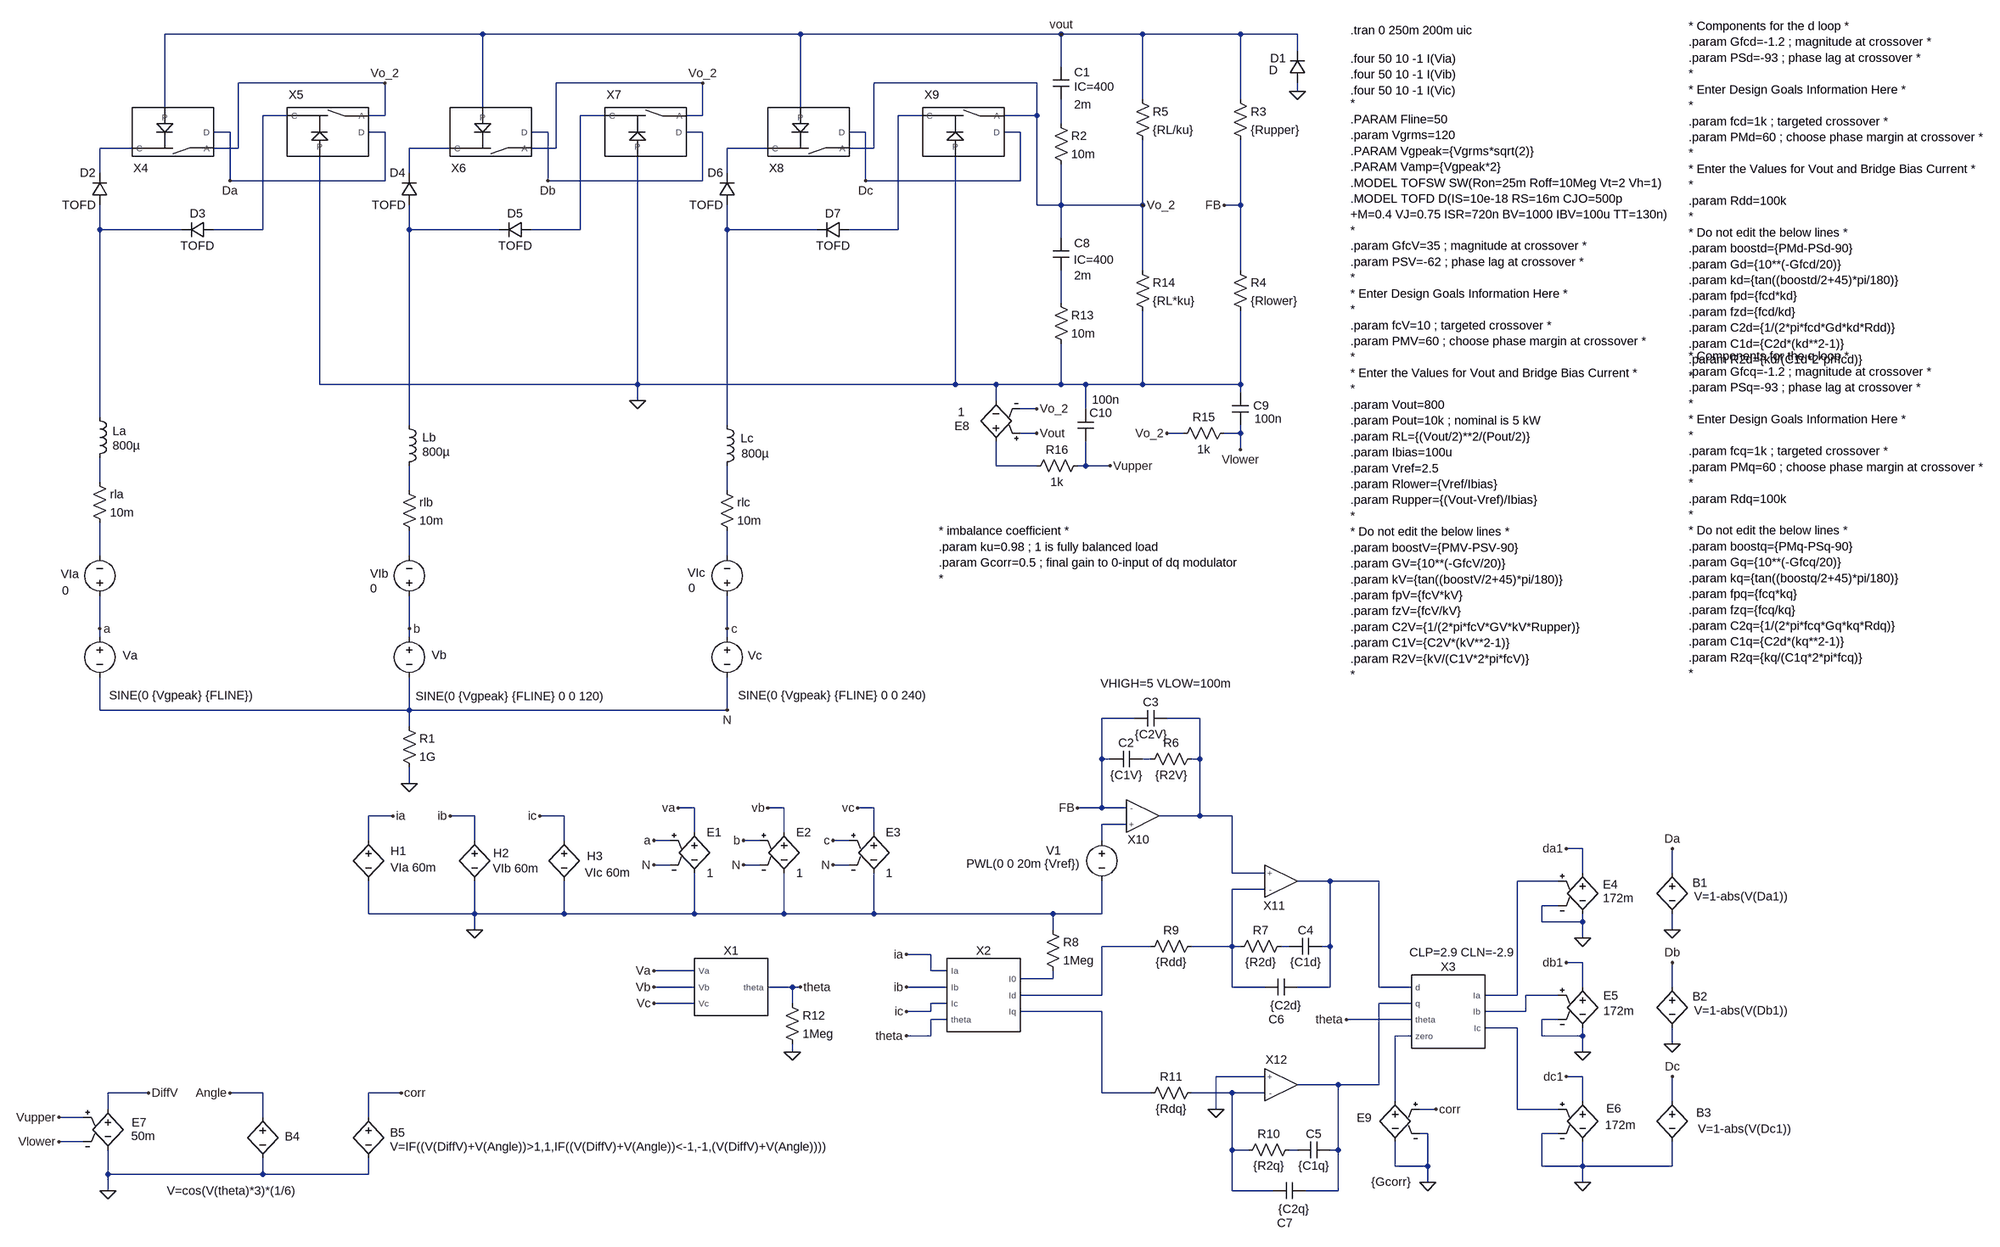
[diagram p0: schematic 3-phase Vienna PFC averaged model - balancing loop.asc]
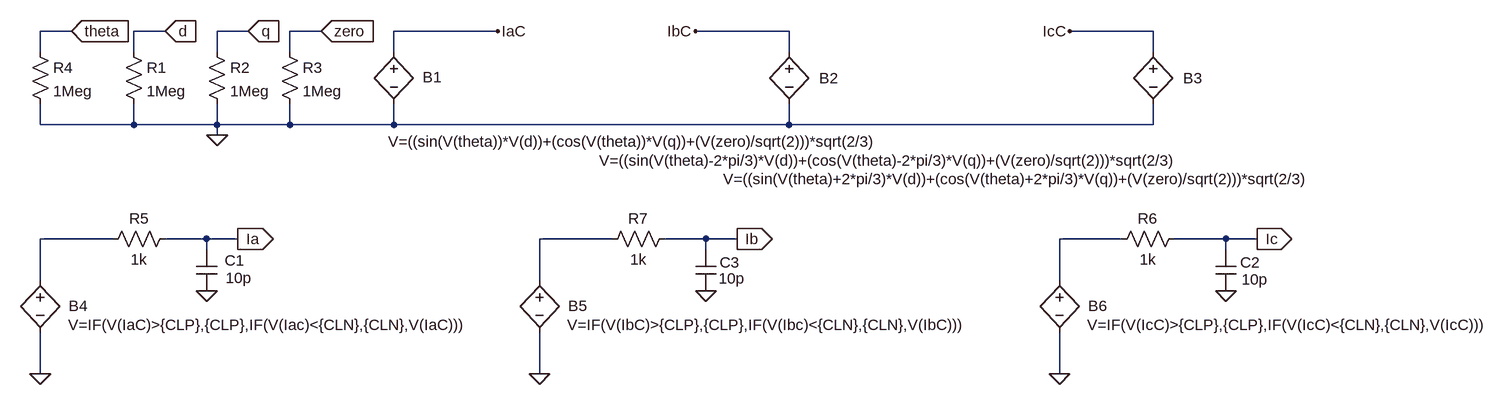
[diagram p1: sub-circuit inverse_dq0.asc]
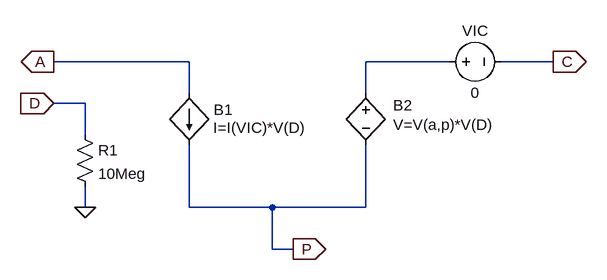
[diagram p2: sub-circuit pwmvm.asc]
3-phase Vienna PFC averaged model - balancing loop.asc, the LTspice schematic file:
Version 4
SHEET 1 4316 1596
WIRE 256 -992 -368 -992
WIRE 880 -992 256 -992
WIRE 1392 -992 880 -992
WIRE 1552 -992 1392 -992
WIRE 1744 -992 1552 -992
WIRE 1856 -992 1744 -992
WIRE 1856 -960 1856 -992
WIRE 1392 -928 1392 -992
WIRE 64 -896 -224 -896
WIRE 688 -896 400 -896
WIRE 1344 -896 1024 -896
WIRE 1856 -880 1856 -896
WIRE 1552 -864 1552 -992
WIRE 1744 -864 1744 -992
WIRE -368 -848 -368 -992
WIRE 256 -848 256 -992
WIRE 880 -848 880 -992
WIRE -128 -832 -176 -832
WIRE 64 -832 64 -896
WIRE 64 -832 32 -832
WIRE 496 -832 448 -832
WIRE 688 -832 688 -896
WIRE 688 -832 656 -832
WIRE 1120 -832 1072 -832
WIRE 1344 -832 1344 -896
WIRE 1344 -832 1280 -832
WIRE 1392 -816 1392 -864
WIRE -240 -800 -272 -800
WIRE 64 -800 32 -800
WIRE 384 -800 352 -800
WIRE 688 -800 656 -800
WIRE 1008 -800 976 -800
WIRE 1312 -800 1280 -800
WIRE -432 -768 -496 -768
WIRE -224 -768 -224 -896
WIRE -224 -768 -272 -768
WIRE 192 -768 112 -768
WIRE 400 -768 400 -896
WIRE 400 -768 352 -768
WIRE 816 -768 736 -768
WIRE 1024 -768 1024 -896
WIRE 1024 -768 976 -768
WIRE -496 -720 -496 -768
WIRE 112 -720 112 -768
WIRE 736 -720 736 -768
WIRE -240 -704 -240 -800
WIRE 64 -704 64 -800
WIRE 64 -704 -240 -704
WIRE 384 -704 384 -800
WIRE 688 -704 688 -800
WIRE 688 -704 384 -704
WIRE 1008 -704 1008 -800
WIRE 1312 -704 1312 -800
WIRE 1312 -704 1008 -704
WIRE 1344 -656 1344 -832
WIRE 1392 -656 1392 -736
WIRE 1392 -656 1344 -656
WIRE 1552 -656 1552 -784
WIRE 1552 -656 1392 -656
WIRE 1744 -656 1744 -784
WIRE 1744 -656 1712 -656
WIRE -496 -608 -496 -656
WIRE -336 -608 -496 -608
WIRE -176 -608 -176 -832
WIRE -176 -608 -272 -608
WIRE 112 -608 112 -656
WIRE 288 -608 112 -608
WIRE 448 -608 448 -832
WIRE 448 -608 352 -608
WIRE 736 -608 736 -656
WIRE 912 -608 736 -608
WIRE 1072 -608 1072 -832
WIRE 1072 -608 976 -608
WIRE 1392 -592 1392 -656
WIRE 1552 -528 1552 -656
WIRE 1744 -528 1744 -656
WIRE 1392 -464 1392 -528
WIRE -64 -304 -64 -752
WIRE 560 -304 560 -752
WIRE 560 -304 -64 -304
WIRE 1184 -304 1184 -752
WIRE 1184 -304 560 -304
WIRE 1264 -304 1184 -304
WIRE 1392 -304 1392 -384
WIRE 1392 -304 1264 -304
WIRE 1440 -304 1392 -304
WIRE 1552 -304 1552 -448
WIRE 1552 -304 1440 -304
WIRE 1744 -304 1744 -448
WIRE 1744 -304 1552 -304
WIRE 1744 -288 1744 -304
WIRE 560 -272 560 -304
WIRE 1264 -272 1264 -304
WIRE 1344 -256 1312 -256
WIRE 1440 -256 1440 -304
WIRE -496 -240 -496 -608
WIRE 112 -224 112 -608
WIRE 736 -224 736 -608
WIRE 1344 -208 1312 -208
WIRE 1632 -208 1600 -208
WIRE 1744 -208 1744 -224
WIRE 1744 -208 1712 -208
WIRE 1744 -176 1744 -208
WIRE 1264 -144 1264 -192
WIRE 1344 -144 1264 -144
WIRE 1440 -144 1440 -192
WIRE 1440 -144 1424 -144
WIRE 1488 -144 1440 -144
WIRE -496 -112 -496 -160
WIRE 112 -96 112 -144
WIRE 736 -96 736 -144
WIRE -496 32 -496 -32
WIRE 112 32 112 -16
WIRE 736 32 736 -16
WIRE -496 176 -496 112
WIRE 112 176 112 112
WIRE 736 176 736 112
WIRE -496 192 -496 176
WIRE 112 192 112 176
WIRE 736 192 736 176
WIRE -496 336 -496 272
WIRE 112 336 112 272
WIRE 112 336 -496 336
WIRE 736 336 736 272
WIRE 736 336 112 336
WIRE 1536 352 1472 352
WIRE 1664 352 1600 352
WIRE 112 368 112 336
WIRE 1472 432 1472 352
WIRE 1488 432 1472 432
WIRE 1568 432 1552 432
WIRE 1664 432 1664 352
WIRE 1664 432 1648 432
WIRE 112 480 112 448
WIRE 672 528 640 528
WIRE 848 528 816 528
WIRE 1024 528 992 528
WIRE 1472 528 1472 432
WIRE 1472 528 1424 528
WIRE 1520 528 1472 528
WIRE 80 544 32 544
WIRE 240 544 192 544
WIRE 416 544 368 544
WIRE 1664 544 1664 432
WIRE 1664 544 1584 544
WIRE 1728 544 1664 544
WIRE 1520 560 1472 560
WIRE 672 576 672 528
WIRE 848 576 848 528
WIRE 1024 576 1024 528
WIRE 32 592 32 544
WIRE 240 592 240 544
WIRE 416 592 416 544
WIRE 624 592 592 592
WIRE 800 592 768 592
WIRE 976 592 944 592
WIRE 1472 592 1472 560
WIRE 2416 608 2384 608
WIRE 624 640 592 640
WIRE 800 640 768 640
WIRE 976 640 944 640
WIRE 1728 656 1728 544
WIRE 1792 656 1728 656
WIRE 2416 656 2416 608
WIRE 2592 656 2592 608
WIRE 1920 672 1856 672
WIRE 2016 672 1920 672
WIRE 2368 672 2288 672
WIRE 1792 688 1728 688
WIRE 2368 720 2336 720
WIRE 32 736 32 672
WIRE 240 736 240 672
WIRE 240 736 32 736
WIRE 416 736 416 672
WIRE 416 736 240 736
WIRE 672 736 672 656
WIRE 672 736 416 736
WIRE 848 736 848 656
WIRE 848 736 672 736
WIRE 1024 736 1024 656
WIRE 1024 736 848 736
WIRE 1376 736 1024 736
WIRE 1472 736 1472 672
WIRE 1472 736 1376 736
WIRE 2336 752 2336 720
WIRE 2416 752 2416 736
WIRE 2416 752 2336 752
WIRE 240 768 240 736
WIRE 1376 768 1376 736
WIRE 2592 768 2592 736
WIRE 2416 784 2416 752
WIRE 1568 800 1472 800
WIRE 1728 800 1728 688
WIRE 1728 800 1648 800
WIRE 1744 800 1728 800
WIRE 1840 800 1824 800
WIRE 1920 800 1920 672
WIRE 1920 800 1904 800
WIRE 1136 816 1088 816
WIRE 2416 832 2384 832
WIRE 672 848 592 848
WIRE 1136 848 1136 816
WIRE 1168 848 1136 848
WIRE 1376 864 1376 848
WIRE 1376 864 1312 864
WIRE 672 880 592 880
WIRE 864 880 816 880
WIRE 880 880 864 880
WIRE 1168 880 1088 880
WIRE 1728 880 1728 800
WIRE 1792 880 1728 880
WIRE 1920 880 1920 800
WIRE 1920 880 1856 880
WIRE 2016 880 2016 672
WIRE 2080 880 2016 880
WIRE 2416 880 2416 832
WIRE 2592 880 2592 832
WIRE 1472 896 1472 800
WIRE 1472 896 1312 896
WIRE 2288 896 2288 672
WIRE 2288 896 2224 896
WIRE 2368 896 2304 896
WIRE 672 912 592 912
WIRE 864 912 864 880
WIRE 1168 912 1136 912
WIRE 2080 912 2016 912
WIRE 1136 928 1136 912
WIRE 1136 928 1088 928
WIRE 1472 928 1312 928
WIRE 2304 928 2304 896
WIRE 2304 928 2224 928
WIRE 1168 944 1136 944
WIRE 2080 944 1952 944
WIRE 2368 944 2336 944
WIRE 2288 960 2224 960
WIRE 1136 976 1136 944
WIRE 1136 976 1088 976
WIRE 2080 976 2048 976
WIRE 2336 976 2336 944
WIRE 2416 976 2416 960
WIRE 2416 976 2336 976
WIRE 2592 992 2592 960
WIRE 864 1008 864 992
WIRE 2416 1008 2416 976
WIRE 1792 1056 1696 1056
WIRE 2416 1056 2384 1056
WIRE 1936 1072 1856 1072
WIRE 2016 1072 2016 912
WIRE 2016 1072 1936 1072
WIRE -400 1088 -480 1088
WIRE -176 1088 -240 1088
WIRE 96 1088 32 1088
WIRE 1472 1088 1472 928
WIRE 1568 1088 1472 1088
WIRE 1728 1088 1648 1088
WIRE 1792 1088 1728 1088
WIRE 2048 1104 2048 976
WIRE 2416 1104 2416 1056
WIRE 2592 1104 2592 1056
WIRE -480 1120 -480 1088
WIRE 1696 1120 1696 1056
WIRE 2128 1120 2096 1120
WIRE 2288 1120 2288 960
WIRE 2368 1120 2288 1120
WIRE -528 1136 -576 1136
WIRE -176 1136 -176 1088
WIRE 32 1136 32 1088
WIRE 2112 1168 2096 1168
WIRE 2368 1168 2336 1168
WIRE -528 1184 -576 1184
WIRE 1728 1200 1728 1088
WIRE 1760 1200 1728 1200
WIRE 1856 1200 1840 1200
WIRE 1936 1200 1936 1072
WIRE 1936 1200 1920 1200
WIRE 2048 1232 2048 1184
WIRE 2112 1232 2112 1168
WIRE 2112 1232 2048 1232
WIRE 2336 1232 2336 1168
WIRE 2416 1232 2416 1184
WIRE 2416 1232 2336 1232
WIRE 2592 1232 2592 1184
WIRE 2592 1232 2416 1232
WIRE -480 1248 -480 1200
WIRE -176 1248 -176 1216
WIRE -176 1248 -480 1248
WIRE 32 1248 32 1216
WIRE 32 1248 -176 1248
WIRE 2112 1264 2112 1232
WIRE 2416 1264 2416 1232
WIRE -480 1280 -480 1248
WIRE 1728 1280 1728 1200
WIRE 1808 1280 1728 1280
WIRE 1936 1280 1936 1200
WIRE 1936 1280 1872 1280
FLAG 112 480 0
FLAG 80 544 ia
FLAG 192 544 ib
FLAG 368 544 ic
FLAG -496 176 a
FLAG 112 176 b
FLAG 736 176 c
FLAG 240 768 0
FLAG 640 528 va
FLAG 736 336 N
FLAG 592 640 N
FLAG 592 592 a
FLAG 816 528 vb
FLAG 768 640 N
FLAG 768 592 b
FLAG 992 528 vc
FLAG 944 640 N
FLAG 944 592 c
FLAG 880 880 theta
FLAG 592 848 Va
FLAG 592 880 Vb
FLAG 592 912 Vc
FLAG 1088 816 ia
FLAG 1088 880 ib
FLAG 1088 928 ic
FLAG 1088 976 theta
FLAG 1424 528 FB
FLAG 1696 1120 0
FLAG 1952 944 theta
FLAG 864 1008 0
FLAG 2384 608 da1
FLAG 2416 784 0
FLAG 2384 832 db1
FLAG 2416 1008 0
FLAG 2384 1056 dc1
FLAG 2416 1264 0
FLAG -240 -704 Da
FLAG 1712 -656 FB
FLAG 1552 -656 Vo_2
FLAG 64 -896 Vo_2
FLAG 384 -704 Db
FLAG 688 -896 Vo_2
FLAG 1008 -704 Dc
FLAG 1856 -880 0
FLAG 2592 768 0
FLAG 2592 992 0
FLAG 2592 608 Da
FLAG 2592 832 Db
FLAG 2592 1056 Dc
FLAG 560 -272 0
FLAG 1392 -992 vout
FLAG -576 1136 Vupper
FLAG -576 1184 Vlower
FLAG -480 1280 0
FLAG -400 1088 DiffV
FLAG -240 1088 Angle
FLAG 96 1088 corr
FLAG 1600 -208 Vo_2
FLAG 1744 -176 Vlower
FLAG 1344 -256 Vo_2
FLAG 1344 -208 Vout
FLAG 1488 -144 Vupper
FLAG 2128 1120 corr
FLAG 2112 1264 0
SYMBOL voltage -496 176 R0
WINDOW 0 45 53 Left 2
WINDOW 3 19 131 Left 2
WINDOW 123 0 0 Left 0
WINDOW 39 0 0 Left 0
SYMATTR InstName Va
SYMATTR Value SINE(0 {Vgpeak} {FLINE})
SYMBOL voltage 112 176 R0
WINDOW 0 44 52 Left 2
WINDOW 3 12 133 Left 2
WINDOW 123 0 0 Left 0
WINDOW 39 0 0 Left 0
SYMATTR InstName Vb
SYMATTR Value SINE(0 {Vgpeak} {FLINE} 0 0 120)
SYMBOL voltage 736 176 R0
WINDOW 0 41 53 Left 2
WINDOW 3 22 131 Left 2
WINDOW 123 0 0 Left 0
WINDOW 39 0 0 Left 0
SYMATTR InstName Vc
SYMATTR Value SINE(0 {Vgpeak} {FLINE} 0 0 240)
SYMBOL res 96 352 R0
SYMATTR InstName R1
SYMATTR Value 1G
SYMBOL res -512 -128 R0
SYMATTR InstName rla
SYMATTR Value 10m
SYMBOL res 96 -112 R0
SYMATTR InstName rlb
SYMATTR Value 10m
SYMBOL res 720 -112 R0
SYMATTR InstName rlc
SYMATTR Value 10m
SYMBOL h 32 576 R0
WINDOW 0 43 37 Left 2
WINDOW 3 43 69 Left 2
SYMATTR InstName H1
SYMATTR Value VIa 60m
SYMBOL h 240 576 R0
WINDOW 0 37 41 Left 2
WINDOW 3 36 71 Left 2
SYMATTR InstName H2
SYMATTR Value VIb 60m
SYMBOL h 416 576 R0
WINDOW 0 45 47 Left 2
WINDOW 3 41 79 Left 2
SYMATTR InstName H3
SYMATTR Value VIc 60m
SYMBOL ind -512 -256 R0
WINDOW 0 41 44 Left 2
WINDOW 3 41 72 Left 2
SYMATTR InstName La
SYMATTR Value 800µ
SYMBOL ind 96 -240 R0
WINDOW 0 42 40 Left 2
WINDOW 3 42 69 Left 2
SYMATTR InstName Lb
SYMATTR Value 800µ
SYMBOL ind 720 -240 R0
WINDOW 0 43 42 Left 2
WINDOW 3 44 72 Left 2
SYMATTR InstName Lc
SYMATTR Value 800µ
SYMBOL voltage -496 128 R180
WINDOW 0 40 59 Left 2
WINDOW 3 60 27 Left 2
WINDOW 123 0 0 Left 0
WINDOW 39 0 0 Left 0
SYMATTR InstName VIa
SYMATTR Value 0
SYMBOL voltage 112 128 R180
WINDOW 0 41 60 Left 2
WINDOW 3 63 31 Left 2
WINDOW 123 0 0 Left 0
WINDOW 39 0 0 Left 0
SYMATTR InstName VIb
SYMATTR Value 0
SYMBOL voltage 736 128 R180
WINDOW 0 43 62 Left 2
WINDOW 3 62 32 Left 2
WINDOW 123 0 0 Left 0
WINDOW 39 0 0 Left 0
SYMATTR InstName VIc
SYMATTR Value 0
SYMBOL e 672 560 R0
SYMATTR InstName E1
SYMATTR Value 1
SYMBOL e 848 560 R0
SYMATTR InstName E2
SYMATTR Value 1
SYMBOL e 1024 560 R0
SYMATTR InstName E3
SYMATTR Value 1
SYMBOL theta_sub 736 880 R0
SYMATTR InstName X1
SYMBOL dq0_sub 1232 896 R0
SYMATTR InstName X2
SYMBOL res 1664 416 R90
WINDOW 0 0 56 VBottom 2
WINDOW 3 32 56 VTop 2
SYMATTR InstName R6
SYMATTR Value {R2V}
SYMBOL cap 1552 416 R90
WINDOW 0 0 32 VBottom 2
WINDOW 3 32 32 VTop 2
SYMATTR InstName C2
SYMATTR Value {C1V}
SYMBOL cap 1600 336 R90
WINDOW 0 0 32 VBottom 2
WINDOW 3 32 32 VTop 2
SYMATTR InstName C3
SYMATTR Value {C2V}
SYMBOL res 1728 816 R270
WINDOW 0 32 56 VTop 2
WINDOW 3 0 56 VBottom 2
SYMATTR InstName R7
SYMATTR Value {R2d}
SYMBOL cap 1840 816 R270
WINDOW 0 32 32 VTop 2
WINDOW 3 0 32 VBottom 2
SYMATTR InstName C4
SYMATTR Value {C1d}
SYMBOL cap 1792 896 R270
WINDOW 0 -63 23 VTop 2
WINDOW 3 -5 41 VBottom 2
SYMATTR InstName C6
SYMATTR Value {C2d}
SYMBOL res 1360 752 R0
SYMATTR InstName R8
SYMATTR Value 1Meg
SYMBOL res 1664 784 R90
WINDOW 0 0 56 VBottom 2
WINDOW 3 32 56 VTop 2
SYMATTR InstName R9
SYMATTR Value {Rdd}
SYMBOL res 1744 1216 R270
WINDOW 0 32 56 VTop 2
WINDOW 3 0 56 VBottom 2
SYMATTR InstName R10
SYMATTR Value {R2q}
SYMBOL cap 1856 1216 R270
WINDOW 0 32 32 VTop 2
WINDOW 3 0 32 VBottom 2
SYMATTR InstName C5
SYMATTR Value {C1q}
SYMBOL cap 1808 1296 R270
WINDOW 0 -63 23 VTop 2
WINDOW 3 -5 41 VBottom 2
SYMATTR InstName C7
SYMATTR Value {C2q}
SYMBOL res 1664 1072 R90
WINDOW 0 0 56 VBottom 2
WINDOW 3 32 56 VTop 2
SYMATTR InstName R11
SYMATTR Value {Rdq}
SYMBOL Inverse_dq0 2144 928 R0
WINDOW 39 35 -100 Bottom 2
SYMATTR SpiceLine CLP=2.9 CLN=-2.9
SYMATTR InstName X3
SYMBOL res 848 896 R0
SYMATTR InstName R12
SYMATTR Value 1Meg
SYMBOL opampTOF 1584 528 R0
WINDOW 0 -40 78 Bottom 2
WINDOW 39 13 -229 Bottom 2
SYMATTR InstName X10
SYMATTR SpiceLine VHIGH=5 VLOW=100m
SYMBOL opampTOF 1856 688 M180
WINDOW 0 -45 -17 Bottom 2
SYMATTR InstName X11
SYMATTR SpiceLine VHIGH=8 VLOW=-8
SYMBOL opampTOF 1856 1088 M180
WINDOW 0 -41 81 Bottom 2
SYMATTR InstName X12
SYMATTR SpiceLine VHIGH=8 VLOW=-8
SYMBOL e 2416 640 R0
WINDOW 0 40 39 Left 2
WINDOW 3 40 65 Left 2
SYMATTR InstName E4
SYMATTR Value 172m
SYMBOL e 2416 864 R0
WINDOW 0 41 33 Left 2
WINDOW 3 41 63 Left 2
SYMATTR InstName E5
SYMATTR Value 172m
SYMBOL e 2416 1088 R0
WINDOW 0 47 31 Left 2
WINDOW 3 44 63 Left 2
SYMATTR InstName E6
SYMATTR Value 172m
SYMBOL diode 1872 -896 R180
WINDOW 0 39 49 Left 2
WINDOW 3 55 25 Left 2
SYMATTR InstName D1
SYMBOL PWMVM -336 -784 R180
WINDOW 0 79 -40 Bottom 2
SYMATTR InstName X4
SYMBOL cap 1376 -928 R0
WINDOW 0 42 11 Left 2
WINDOW 3 42 74 Left 2
WINDOW 123 42 39 Left 2
SYMATTR InstName C1
SYMATTR Value 2m
SYMATTR Value2 IC=400
SYMBOL res 1376 -832 R0
SYMATTR InstName R2
SYMATTR Value 10m
SYMBOL res 1728 -880 R0
SYMATTR InstName R3
SYMATTR Value {Rupper}
SYMBOL res 1728 -544 R0
SYMATTR InstName R4
SYMATTR Value {Rlower}
SYMBOL res 1536 -880 R0
SYMATTR InstName R5
SYMATTR Value {RL/ku}
SYMBOL cap 1376 -592 R0
WINDOW 0 42 11 Left 2
WINDOW 3 42 74 Left 2
WINDOW 123 41 43 Left 2
SYMATTR InstName C8
SYMATTR Value 2m
SYMATTR Value2 IC=400
SYMBOL res 1376 -480 R0
SYMATTR InstName R13
SYMATTR Value 10m
SYMBOL res 1536 -544 R0
SYMATTR InstName R14
SYMATTR Value {RL*ku}
SYMBOL diode -480 -656 R180
WINDOW 0 24 64 Left 2
WINDOW 3 24 0 Left 2
SYMATTR InstName D2
SYMATTR Value TOFD
SYMBOL diode -272 -624 R90
WINDOW 0 0 32 VBottom 2
WINDOW 3 32 32 VTop 2
SYMATTR InstName D3
SYMATTR Value TOFD
SYMBOL PWMVM -32 -816 M0
WINDOW 0 78 -41 Bottom 2
SYMATTR InstName X5
SYMBOL PWMVM 288 -784 R180
WINDOW 0 79 -40 Bottom 2
SYMATTR InstName X6
SYMBOL diode 128 -656 R180
WINDOW 0 24 64 Left 2
WINDOW 3 24 0 Left 2
SYMATTR InstName D4
SYMATTR Value TOFD
SYMBOL diode 352 -624 R90
WINDOW 0 0 32 VBottom 2
WINDOW 3 32 32 VTop 2
SYMATTR InstName D5
SYMATTR Value TOFD
SYMBOL PWMVM 592 -816 M0
WINDOW 0 78 -41 Bottom 2
SYMATTR InstName X7
SYMBOL PWMVM 912 -784 R180
WINDOW 0 79 -40 Bottom 2
SYMATTR InstName X8
SYMBOL diode 752 -656 R180
WINDOW 0 24 64 Left 2
WINDOW 3 24 0 Left 2
SYMATTR InstName D6
SYMATTR Value TOFD
SYMBOL diode 976 -624 R90
WINDOW 0 0 32 VBottom 2
WINDOW 3 32 32 VTop 2
SYMATTR InstName D7
SYMATTR Value TOFD
SYMBOL PWMVM 1216 -816 M0
WINDOW 0 78 -41 Bottom 2
SYMATTR InstName X9
SYMBOL bv 2592 640 R0
WINDOW 0 40 35 Left 2
WINDOW 3 43 62 Left 2
SYMATTR InstName B1
SYMATTR Value V=1-abs(V(Da1))
SYMBOL bv 2592 864 R0
WINDOW 0 40 35 Left 2
WINDOW 3 43 62 Left 2
SYMATTR InstName B2
SYMATTR Value V=1-abs(V(Db1))
SYMBOL bv 2592 1088 R0
WINDOW 0 47 39 Left 2
WINDOW 3 51 71 Left 2
SYMATTR InstName B3
SYMATTR Value V=1-abs(V(Dc1))
SYMBOL voltage 1472 576 M0
WINDOW 0 80 36 Left 2
WINDOW 3 43 62 Left 2
WINDOW 123 0 0 Left 0
WINDOW 39 0 0 Left 0
SYMATTR InstName V1
SYMATTR Value PWL(0 0 20m {Vref})
SYMBOL e -480 1104 R0
WINDOW 0 47 42 Left 2
WINDOW 3 46 69 Left 2
SYMATTR InstName E7
SYMATTR Value 50m
SYMBOL bv -176 1120 R0
WINDOW 0 44 54 Left 2
WINDOW 3 -188 160 Left 2
SYMATTR InstName B4
SYMATTR Value V=cos(V(theta)*3)*(1/6)
SYMBOL bv 32 1120 R0
WINDOW 0 42 46 Left 2
WINDOW 3 42 74 Left 2
SYMATTR InstName B5
SYMATTR Value V=IF((V(DiffV)+V(Angle))>1,1,IF((V(DiffV)+V(Angle))<-1,-1,(V(DiffV)+V(Angle))))
SYMBOL res 1728 -224 R90
WINDOW 0 0 56 VBottom 2
WINDOW 3 32 56 VTop 2
SYMATTR InstName R15
SYMATTR Value 1k
SYMBOL cap 1728 -288 R0
WINDOW 0 41 26 Left 2
WINDOW 3 44 52 Left 2
SYMATTR InstName C9
SYMATTR Value 100n
SYMBOL res 1440 -160 R90
WINDOW 0 0 56 VBottom 2
WINDOW 3 32 56 VTop 2
SYMATTR InstName R16
SYMATTR Value 1k
SYMBOL cap 1424 -256 R0
WINDOW 3 29 -18 Left 2
SYMATTR Value 100n
SYMATTR InstName C10
SYMBOL e 1264 -176 R180
WINDOW 0 52 46 Left 2
WINDOW 3 61 74 Left 2
SYMATTR InstName E8
SYMATTR Value 1
SYMBOL e 2048 1088 M0
WINDOW 0 46 49 Left 2
WINDOW 3 -30 175 Left 2
SYMATTR InstName E9
SYMATTR Value {Gcorr}
TEXT 1960 -856 Left 2 !*\n.PARAM Fline=50\n.param Vgrms=120\n.PARAM Vgpeak={Vgrms*sqrt(2)}\n.PARAM Vamp={Vgpeak*2}\n.MODEL TOFSW SW(Ron=25m Roff=10Meg Vt=2 Vh=1)\n.MODEL TOFD D(IS=10e-18 RS=16m CJO=500p \n+M=0.4 VJ=0.75 ISR=720n BV=1000 IBV=100u TT=130n)\n*
TEXT 1960 -1000 Left 2 !.tran 0 250m 200m uic
TEXT 1960 -944 Left 2 !.four 50 10 -1 I(Via)\n.four 50 10 -1 I(Vib)\n.four 50 10 -1 I(Vic)
TEXT 2624 -1008 Left 2 !* Components for the d loop *\n.param Gfcd=-1.2 ; magnitude at crossover *\n.param PSd=-93 ; phase lag at crossover *\n*\n* Enter Design Goals Information Here *\n*\n.param fcd=1k ; targeted crossover *\n.param PMd=60 ; choose phase margin at crossover *\n*\n* Enter the Values for Vout and Bridge Bias Current *\n*\n.param Rdd=100k\n*\n* Do not edit the below lines *\n.param boostd={PMd-PSd-90}\n.param Gd={10**(-Gfcd/20)}\n.param kd={tan((boostd/2+45)*pi/180)}\n.param fpd={fcd*kd}\n.param fzd={fcd/kd}\n.param C2d={1/(2*pi*fcd*Gd*kd*Rdd)}\n.param C1d={C2d*(kd**2-1)}\n.param R2d={kd/(C1d*2*pi*fcd)}\n*
TEXT 2624 -360 Left 2 !* Components for the q loop *\n.param Gfcq=-1.2 ; magnitude at crossover *\n.param PSq=-93 ; phase lag at crossover *\n*\n* Enter Design Goals Information Here *\n*\n.param fcq=1k ; targeted crossover *\n.param PMq=60 ; choose phase margin at crossover *\n*\n.param Rdq=100k\n*\n* Do not edit the below lines *\n.param boostq={PMq-PSq-90}\n.param Gq={10**(-Gfcq/20)}\n.param kq={tan((boostq/2+45)*pi/180)}\n.param fpq={fcq*kq}\n.param fzq={fcq/kq}\n.param C2q={1/(2*pi*fcq*Gq*kq*Rdq)}\n.param C1q={C2d*(kq**2-1)}\n.param R2q={kq/(C1q*2*pi*fcq)}\n*
TEXT 1960 -576 Left 2 !.param GfcV=35 ; magnitude at crossover *\n.param PSV=-62 ; phase lag at crossover *\n*\n* Enter Design Goals Information Here *\n*\n.param fcV=10 ; targeted crossover *\n.param PMV=60 ; choose phase margin at crossover *\n*\n* Enter the Values for Vout and Bridge Bias Current *\n*\n.param Vout=800\n.param Pout=10k ; nominal is 5 kW\n.param RL={(Vout/2)**2/(Pout/2)}\n.param Ibias=100u\n.param Vref=2.5\n.param Rlower={Vref/Ibias}\n.param Rupper={(Vout-Vref)/Ibias}\n*\n* Do not edit the below lines *\n.param boostV={PMV-PSV-90}\n.param GV={10**(-GfcV/20)}\n.param kV={tan((boostV/2+45)*pi/180)}\n.param fpV={fcV*kV}\n.param fzV={fcV/kV}\n.param C2V={1/(2*pi*fcV*GV*kV*Rupper)}\n.param C1V={C2V*(kV**2-1)}\n.param R2V={kV/(C1V*2*pi*fcV)}\n*
TEXT 1152 -16 Left 2 !* imbalance coefficient *\n.param ku=0.98 ; 1 is fully balanced load\n.param Gcorr=0.5 ; final gain to 0-input of dq modulator\n*

inverse_dq0.asc, the sub-circuit schematic file:
Version 4
SHEET 1 1804 980
WIRE -464 16 -512 16
WIRE -320 16 -368 16
WIRE -192 16 -240 16
WIRE -80 16 -128 16
WIRE 192 16 32 16
WIRE 640 16 496 16
WIRE 1200 16 1072 16
WIRE -512 48 -512 16
WIRE -368 48 -368 16
WIRE -240 48 -240 16
WIRE -128 48 -128 16
WIRE 32 48 32 16
WIRE 640 48 640 16
WIRE 1200 48 1200 16
WIRE -512 160 -512 128
WIRE -368 160 -368 128
WIRE -368 160 -512 160
WIRE -240 160 -240 128
WIRE -240 160 -368 160
WIRE -128 160 -128 128
WIRE -128 160 -240 160
WIRE 32 160 32 128
WIRE 32 160 -128 160
WIRE 640 160 640 128
WIRE 640 160 32 160
WIRE 1200 160 1200 128
WIRE 1200 160 640 160
WIRE -240 176 -240 160
WIRE -400 336 -512 336
WIRE -256 336 -320 336
WIRE -208 336 -256 336
WIRE 368 336 256 336
WIRE 512 336 448 336
WIRE 560 336 512 336
WIRE 1152 336 1056 336
WIRE 1312 336 1232 336
WIRE 1360 336 1312 336
WIRE -256 352 -256 336
WIRE 512 352 512 336
WIRE 1312 352 1312 336
WIRE -512 400 -512 336
WIRE 256 400 256 336
WIRE 1056 400 1056 336
WIRE -512 544 -512 480
WIRE 256 544 256 480
WIRE 1056 544 1056 480
FLAG -240 176 0
FLAG -320 16 d
IOPIN -320 16 In
FLAG -192 16 q
IOPIN -192 16 In
FLAG -80 16 zero
IOPIN -80 16 In
FLAG 192 16 IaC
FLAG 496 16 IbC
FLAG 1072 16 IcC
FLAG -464 16 theta
IOPIN -464 16 In
FLAG -208 336 Ia
IOPIN -208 336 Out
FLAG -512 544 0
FLAG 560 336 Ib
IOPIN 560 336 Out
FLAG 256 544 0
FLAG 1360 336 Ic
IOPIN 1360 336 Out
FLAG 1056 544 0
FLAG -256 416 0
FLAG 1312 416 0
FLAG 512 416 0
SYMBOL res -384 32 R0
SYMATTR InstName R1
SYMATTR Value 1Meg
SYMBOL res -256 32 R0
SYMATTR InstName R2
SYMATTR Value 1Meg
SYMBOL res -144 32 R0
SYMATTR InstName R3
SYMATTR Value 1Meg
SYMBOL bv 32 32 R0
WINDOW 0 44 55 Left 2
WINDOW 3 -9 154 Left 2
SYMATTR InstName B1
SYMATTR Value V=((sin(V(theta))*V(d))+(cos(V(theta))*V(q))+(V(zero)/sqrt(2)))*sqrt(2/3)
SYMBOL bv 640 32 R0
WINDOW 0 46 56 Left 2
WINDOW 3 -292 183 Left 2
SYMATTR InstName B2
SYMATTR Value V=((sin(V(theta)-2*pi/3)*V(d))+(cos(V(theta)-2*pi/3)*V(q))+(V(zero)/sqrt(2)))*sqrt(2/3)
SYMBOL res -528 32 R0
SYMATTR InstName R4
SYMATTR Value 1Meg
SYMBOL bv 1200 32 R0
WINDOW 0 46 56 Left 2
WINDOW 3 -661 212 Left 2
SYMATTR InstName B3
SYMATTR Value V=((sin(V(theta)+2*pi/3)*V(d))+(cos(V(theta)+2*pi/3)*V(q))+(V(zero)/sqrt(2)))*sqrt(2/3)
SYMBOL bv -512 384 R0
WINDOW 0 44 55 Left 2
WINDOW 3 43 84 Left 2
SYMATTR InstName B4
SYMATTR Value V=IF(V(IaC)>{CLP},{CLP},IF(V(Iac)<{CLN},{CLN},V(IaC)))
SYMBOL bv 256 384 R0
WINDOW 0 44 55 Left 2
WINDOW 3 43 84 Left 2
SYMATTR InstName B5
SYMATTR Value V=IF(V(IbC)>{CLP},{CLP},IF(V(Ibc)<{CLN},{CLN},V(IbC)))
SYMBOL bv 1056 384 R0
WINDOW 0 44 55 Left 2
WINDOW 3 43 84 Left 2
SYMATTR InstName B6
SYMATTR Value V=IF(V(IcC)>{CLP},{CLP},IF(V(IcC)<{CLN},{CLN},V(IcC)))
SYMBOL res -304 320 R90
WINDOW 0 0 56 VBottom 2
WINDOW 3 32 56 VTop 2
SYMATTR InstName R5
SYMATTR Value 1k
SYMBOL res 1248 320 R90
WINDOW 0 0 56 VBottom 2
WINDOW 3 32 56 VTop 2
SYMATTR InstName R6
SYMATTR Value 1k
SYMBOL res 464 320 R90
WINDOW 0 0 56 VBottom 2
WINDOW 3 32 56 VTop 2
SYMATTR InstName R7
SYMATTR Value 1k
SYMBOL cap -272 352 R0
WINDOW 0 44 17 Left 2
WINDOW 3 45 44 Left 2
SYMATTR InstName C1
SYMATTR Value 10p
SYMBOL cap 1296 352 R0
WINDOW 0 38 20 Left 2
WINDOW 3 40 46 Left 2
SYMATTR InstName C2
SYMATTR Value 10p
SYMBOL cap 496 352 R0
WINDOW 0 37 20 Left 2
WINDOW 3 36 45 Left 2
SYMATTR InstName C3
SYMATTR Value 10p

pwmvm.asc, the sub-circuit schematic file:
Version 4
SHEET 1 880 680
WIRE 64 48 -144 48
WIRE 464 48 336 48
WIRE 624 48 544 48
WIRE 64 96 64 48
WIRE 336 96 336 48
WIRE -96 112 -144 112
WIRE -96 160 -96 112
WIRE -96 272 -96 240
WIRE 64 272 64 176
WIRE 192 272 64 272
WIRE 336 272 336 176
WIRE 336 272 192 272
WIRE 192 336 192 272
WIRE 224 336 192 336
FLAG -96 272 0
FLAG -144 48 A
IOPIN -144 48 Out
FLAG 624 48 C
IOPIN 624 48 Out
FLAG 224 336 P
IOPIN 224 336 Out
FLAG -144 112 D
IOPIN -144 112 In
SYMBOL bi 64 96 R0
WINDOW 0 38 26 Left 2
WINDOW 3 37 53 Left 2
SYMATTR InstName B1
SYMATTR Value I=I(VIC)*V(D)
SYMBOL bv 336 80 R0
WINDOW 0 42 35 Left 2
WINDOW 3 42 65 Left 2
SYMATTR InstName B2
SYMATTR Value V=V(a,p)*V(D)
SYMBOL voltage 448 48 R270
WINDOW 0 32 56 VTop 2
WINDOW 3 -32 56 VBottom 2
WINDOW 123 0 0 Left 0
WINDOW 39 0 0 Left 0
SYMATTR InstName VIC
SYMATTR Value 0
SYMBOL res -112 144 R0
SYMATTR InstName R1
SYMATTR Value 10Meg

The netlist it stands for:
* 3-phase Vienna PFC averaged model - balancing loop.asc
Va a N SINE(0 {Vgpeak} {FLINE})
Vb b N SINE(0 {Vgpeak} {FLINE} 0 0 120)
Vc c N SINE(0 {Vgpeak} {FLINE} 0 0 240)
R1 N 0 1G
rla N013 N016 10m
rlb N014 N017 10m
rlc N015 N018 10m
H1 ia 0 VIa 60m
H2 ib 0 VIb 60m
H3 ic 0 VIc 60m
La N008 N013 800µ
Lb N009 N014 800µ
Lc N010 N015 800µ
VIa a N016 0
VIb b N017 0
VIc c N018 0
E1 va 0 a N 1
E2 vb 0 b N 1
E3 vc 0 c N 1
XX1 va vb vc theta theta_sub  ; pins Va Vb Vc theta
XX2 ia ib ic theta N027 N025 N030 dq0_sub  ; pins Ia Ib Ic theta I0 Id Iq
R6 N019 N020 {R2V}
C2 N020 FB {C1V}
C3 N019 FB {C2V}
R7 N024 N026 {R2d}
C4 N026 N022 {C1d}
C6 N024 N022 {C2d}
R8 0 N027 1Meg
R9 N024 N025 {Rdd}
R10 N033 N034 {R2q}
C5 N034 N029 {C1q}
C7 N033 N029 {C2q}
R11 N033 N030 {Rdq}
XX3 N022 N029 theta N032 N023 N028 N031 inverse_dq0 params: CLP=2.9 CLN=-2.9
R12 theta 0 1Meg
XX10 FB N021 N019 opampTOF params: VHIGH=5 VLOW=100m  ; pins - + OUT
XX11 N024 N019 N022 opampTOF params: VHIGH=8 VLOW=-8  ; pins - + OUT
XX12 N033 0 N029 opampTOF params: VHIGH=8 VLOW=-8  ; pins - + OUT
E4 da1 0 N023 0 172m
E5 db1 0 N028 0 172m
E6 dc1 0 N031 0 172m
D1 0 vout D
XX4 Da Vo_2 N005 vout pwmvm
C1 vout N004 2m IC=400
R2 N004 Vo_2 10m
R3 vout FB {Rupper}
R4 FB 0 {Rlower}
R5 vout Vo_2 {RL/ku}
C8 Vo_2 N011 2m IC=400
R13 N011 0 10m
R14 Vo_2 0 {RL*ku}
D2 N008 N005 TOFD
D3 N001 N008 TOFD
XX5 Da Vo_2 N001 0 pwmvm
XX6 Db Vo_2 N006 vout pwmvm
D4 N009 N006 TOFD
D5 N002 N009 TOFD
XX7 Db Vo_2 N002 0 pwmvm
XX8 Dc Vo_2 N007 vout pwmvm
D6 N010 N007 TOFD
D7 N003 N010 TOFD
XX9 Dc Vo_2 N003 0 pwmvm
B1 Da 0 V=1-abs(V(Da1))
B2 Db 0 V=1-abs(V(Db1))
B3 Dc 0 V=1-abs(V(Dc1))
V1 N021 0 PWL(0 0 20m {Vref})
E7 DiffV 0 Vupper Vlower 50m
B4 Angle 0 V=cos(V(theta)*3)*(1/6)
B5 corr 0 V=IF((V(DiffV)+V(Angle))>1,1,IF((V(DiffV)+V(Angle))<-1,-1,(V(DiffV)+V(Angle))))
R15 Vlower Vo_2 1k
C9 0 Vlower 100n
R16 Vupper N012 1k
C10 0 Vupper 100n
E8 N012 0 vout Vo_2 1
E9 N032 0 corr 0 {Gcorr}

* block symbol definitions
.subckt inverse_dq0 d q theta zero Ia Ib Ic
R1 d 0 1Meg
R2 q 0 1Meg
R3 zero 0 1Meg
B1 IaC 0 V=((sin(V(theta))*V(d))+(cos(V(theta))*V(q))+(V(zero)/sqrt(2)))*sqrt(2/3)
B2 IbC 0 V=((sin(V(theta)-2*pi/3)*V(d))+(cos(V(theta)-2*pi/3)*V(q))+(V(zero)/sqrt(2)))*sqrt(2/3)
R4 theta 0 1Meg
B3 IcC 0 V=((sin(V(theta)+2*pi/3)*V(d))+(cos(V(theta)+2*pi/3)*V(q))+(V(zero)/sqrt(2)))*sqrt(2/3)
B4 N001 0 V=IF(V(IaC)>{CLP},{CLP},IF(V(Iac)<{CLN},{CLN},V(IaC)))
B5 N002 0 V=IF(V(IbC)>{CLP},{CLP},IF(V(Ibc)<{CLN},{CLN},V(IbC)))
B6 N003 0 V=IF(V(IcC)>{CLP},{CLP},IF(V(IcC)<{CLN},{CLN},V(IcC)))
R5 Ia N001 1k
R6 Ic N003 1k
R7 Ib N002 1k
C1 Ia 0 10p
C2 Ic 0 10p
C3 Ib 0 10p
.ends inverse_dq0

.subckt pwmvm D A C P
B1 A P I=I(VIC)*V(D)
B2 N001 P V=V(a,p)*V(D)
VIC N001 C 0
R1 D 0 10Meg
.ends pwmvm

.model D D
.lib standard.dio
*
.PARAM Fline=50
.param Vgrms=120
.PARAM Vgpeak={Vgrms*sqrt(2)}
.PARAM Vamp={Vgpeak*2}
.MODEL TOFSW SW(Ron=25m Roff=10Meg Vt=2 Vh=1)
.MODEL TOFD D(IS=10e-18 RS=16m CJO=500p
+M=0.4 VJ=0.75 ISR=720n BV=1000 IBV=100u TT=130n)
*
.tran 0 250m 200m uic
.four 50 10 -1 I(Via)
.four 50 10 -1 I(Vib)
.four 50 10 -1 I(Vic)
* Components for the d loop *
.param Gfcd=-1.2 ; magnitude at crossover *
.param PSd=-93 ; phase lag at crossover *
*
* Enter Design Goals Information Here *
*
.param fcd=1k ; targeted crossover *
.param PMd=60 ; choose phase margin at crossover *
*
* Enter the Values for Vout and Bridge Bias Current *
*
.param Rdd=100k
*
* Do not edit the below lines *
.param boostd={PMd-PSd-90}
.param Gd={10**(-Gfcd/20)}
.param kd={tan((boostd/2+45)*pi/180)}
.param fpd={fcd*kd}
.param fzd={fcd/kd}
.param C2d={1/(2*pi*fcd*Gd*kd*Rdd)}
.param C1d={C2d*(kd**2-1)}
.param R2d={kd/(C1d*2*pi*fcd)}
*
* Components for the q loop *
.param Gfcq=-1.2 ; magnitude at crossover *
.param PSq=-93 ; phase lag at crossover *
*
* Enter Design Goals Information Here *
*
.param fcq=1k ; targeted crossover *
.param PMq=60 ; choose phase margin at crossover *
*
.param Rdq=100k
*
* Do not edit the below lines *
.param boostq={PMq-PSq-90}
.param Gq={10**(-Gfcq/20)}
.param kq={tan((boostq/2+45)*pi/180)}
.param fpq={fcq*kq}
.param fzq={fcq/kq}
.param C2q={1/(2*pi*fcq*Gq*kq*Rdq)}
.param C1q={C2d*(kq**2-1)}
.param R2q={kq/(C1q*2*pi*fcq)}
*
.param GfcV=35 ; magnitude at crossover *
.param PSV=-62 ; phase lag at crossover *
*
* Enter Design Goals Information Here *
*
.param fcV=10 ; targeted crossover *
.param PMV=60 ; choose phase margin at crossover *
*
* Enter the Values for Vout and Bridge Bias Current *
*
.param Vout=800
.param Pout=10k ; nominal is 5 kW
.param RL={(Vout/2)**2/(Pout/2)}
.param Ibias=100u
.param Vref=2.5
.param Rlower={Vref/Ibias}
.param Rupper={(Vout-Vref)/Ibias}
*
* Do not edit the below lines *
.param boostV={PMV-PSV-90}
.param GV={10**(-GfcV/20)}
.param kV={tan((boostV/2+45)*pi/180)}
.param fpV={fcV*kV}
.param fzV={fcV/kV}
.param C2V={1/(2*pi*fcV*GV*kV*Rupper)}
.param C1V={C2V*(kV**2-1)}
.param R2V={kV/(C1V*2*pi*fcV)}
*
* imbalance coefficient *
.param ku=0.98 ; 1 is fully balanced load
.param Gcorr=0.5 ; final gain to 0-input of dq modulator
*
.backanno
.end